# Altium schematic sheet [03] - Converter.SchDoc
size A3
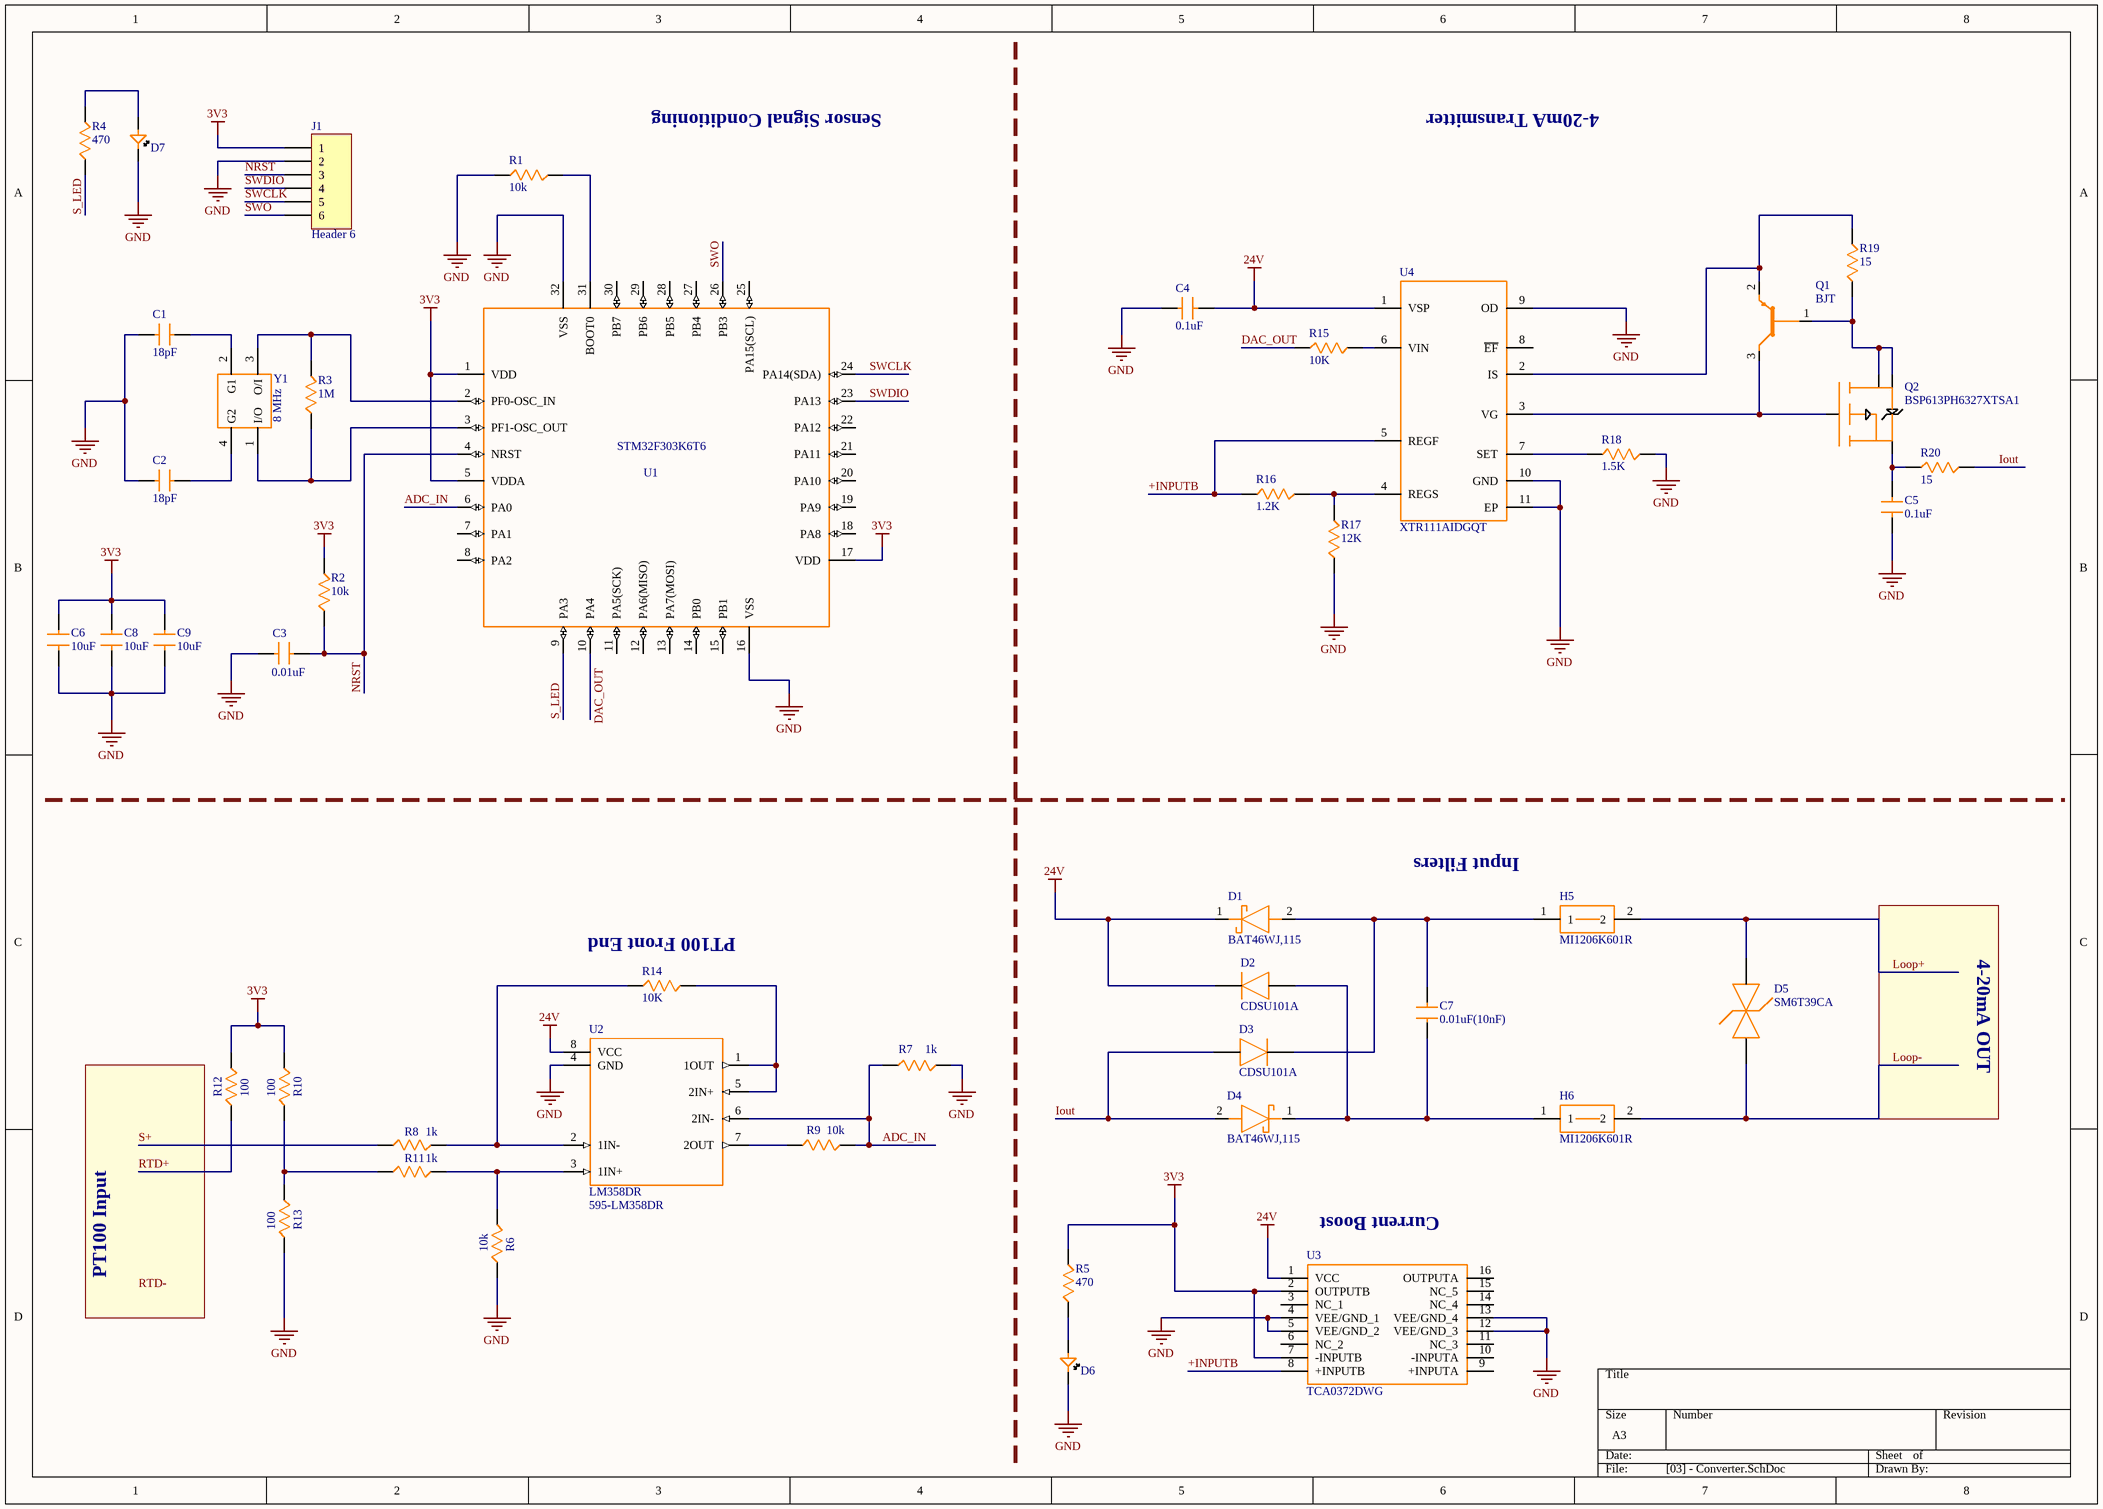
[diagram p0: [03] - Converter.SchDoc]

## Parts
C1  18pF  [C0805]
C2  18pF  [C0805]
C3  0.01uF  [C0805]
C4  0.1uF  [C0805]
C5  0.1uF  [C0805]
C6  10uF  [C0805]
C7  0.01uF(10nF)  [PCBComponent_1]
C8  10uF  [C0805]
C9  10uF  [C0805]
D1  BAT46WJ,115  [BAT46WJ,115]
D2  CDSU101A  [CDSU101A]
D3  CDSU101A  [CDSU101A]
D4  BAT46WJ,115  [BAT46WJ,115]
D5  SM6T39CA  [SM6T39CA]
D6  599-0130-007F  [LED0805]  (value not drawn)
D7  599-0130-007F  [LED0805]  (value not drawn)
H5  MI1206K601R  [MI1206K601R]
H6  MI1206K601R  [MI1206K601R]
J1  Header 6  [HDR1X6]
Q1  BJT  [SMMBT2907ALT3G]
Q2  BSP613PH6327XTSA1  [BSP613PH6327XTA1]
R1  10k  [R0805]
R2  10k  [R0805]
R3  1M  [R0805]
R4  470  [R0805]
R5  470  [R0805]
R6  10k  [R0805]
R7  1k  [R0805]
R8  1k  [R0805]
R9  10k  [R0805]
R10  100  [R0805]
R11  1k  [R0805]
R12  100  [R0805]
R13  100  [R0805]
R14  10K  [R0805]
R15  10K  [R0805]
R16  1.2K  [R0805]
R17  12K  [R0805]
R18  1.5K  [R0805]
R19  15  [R0805]
R20  15  [R0805]
U1  STM32F303K6T6  [STM32F303K6T6]
U2  LM358DR  Supplier Part Number 1: 595-LM358DR  [LM358DR]
U3  TCA0372DWG  [TCA0372DWG]
U4  XTR111AIDGQT  [XTR111AIDGQT]
Y1  8 MHz  [ECS-80-18-30B-AGN]

## Nets
3V3: C6.2 C8.2 C9.2 J1.1 R2.1 R5.2 R10.2 R12.2 U1.1(VDD) U1.5(VDDA) U1.17(VDD) U3.2(OUTPUTB) U3.7(-INPUTB)
24V: C4.1 D1.1(K) D2.1(K) U2.8(VCC) U3.1(VCC) U4.1(VSP)
GND: C1.1 C2.1 C3.1 C4.2 C5.1 C6.1 C8.1 C9.1 D6.2 D7.2 J1.2 R1.1 R6.1 R7.2 R13.1 R17.1 R18.2 U1.16(VSS) U1.32(VSS) U2.4(GND) U3.4(VEE/GND_1) U3.5(VEE/GND_2) U3.12(VEE/GND_3) U3.13(VEE/GND_4) U4.9(OD) U4.10(GND) U4.11(EP)
+INPUTB: R16.1 U3.8(+INPUTB) U4.5(REGF)
ADC_IN: R7.1 R9.1 U1.6(PA0) U2.6(2IN-)
DAC_OUT: R15.2 U1.10(PA4)
Iout: D3.2(A) D4.2(A) R20.1
Loop+: D5.2(A) H5.2
Loop-: D5.1(K) H6.2
NRST: C3.2 J1.3 R2.2 U1.4(NRST)
RTD+: R12.1
S+: R8.1
S_LED: R4.1 U1.9(PA3)
SWCLK: J1.5 U1.24(PA14(SDA))
SWDIO: J1.4 U1.23(PA13)
SWO: J1.6 U1.26(PB3)
NetC1_2: C1.2 Y1.2(G1)
NetC2_2: C2.2 Y1.4(G2)
NetC5_2: C5.2 Q2.3(S) R20.2
NetC7_1: C7.1 D2.2(A) D4.1(K) H6.1
NetC7_2: C7.2 D1.2(A) D3.1(K) H5.1
NetD6_1: D6.1 R5.1
NetD7_1: D7.1 R4.2
NetQ1_1: Q1.1(B) Q2.2(D@1) Q2.4(D@2) R19.1
NetQ1_2: Q1.2(E) R19.2 U4.2(IS)
NetQ1_3: Q1.3(C) Q2.1(G) U4.3(VG)
NetR1_2: R1.2 U1.31(BOOT0)
NetR3_1: R3.1 U1.3(PF1-OSC_OUT) Y1.1(I/O)
NetR3_2: R3.2 U1.2(PF0-OSC_IN) Y1.3(O/I)
NetR6_2: R6.2 R11.2 U2.3(1IN+)
NetR8_2: R8.2 R14.1 U2.2(1IN-)
NetR9_2: R9.2 U2.7(2OUT)
NetR10_1: R10.1 R11.1 R13.2
NetR14_2: R14.2 U2.1(1OUT) U2.5(2IN+)
NetR15_1: R15.1 U4.6(VIN)
NetR16_2: R16.2 R17.2 U4.4(REGS)
NetR18_1: R18.1 U4.7(SET)

Not connected (* = marked no-connect by the designer): U1 7(PA1) 8(PA2) 11(PA5(SCK)) 12(PA6(MISO)) 13(PA7(MOSI)) 14(PB0) 15(PB1) 18(PA8) 19(PA9) 20(PA10) 21(PA11) 22(PA12) 25(PA15(SCL)) 27(PB4) 28(PB5) 29(PB6) 30(PB7); U3 3(NC_1) 6(NC_2) 9(+INPUTA) 10(-INPUTA) 11(NC_3) 14(NC_4) 15(NC_5) 16(OUTPUTA); U4 8(~{EF})

## Notes on the sheet
- Sensor Signal Conditioning
- 4-20mA Transmitter
- Input Filters
- (near R14) PT100 Front End
- 4-20mA OUT
- (near U3) Current Boost
- PT100 Input
- Labels drawn without touching a wire or pin: RTD-

## Library data of the parts
C1 C2 = VJ0805A180KXQPW1BC: Multilayer Ceramic Capacitors MLCC - SMD/SMT 0805 18pF 10volts C0G 10%; Manufacturer: Vishay / Vitramon; Voltage Rating DC: 10 VDC; Class: Class 1; CNHTS: 8532241000; Dielectric: C0G (NP0); TARIC: 8532240000; Supplier 1: Mouser; Manufacturer Part Number: VJ0805A180KXQPW1BC; RoHS: RoHS Compliant; Category: Multilayer Ceramic Capacitors MLCC - SMD/SMT; Stock 1: 27135; Pricing 1: 1=0.120, 50=0.094, 100=0.071, 500=0.050, 1000=0.026, 15000=0.018 (USD); Capacitance: 18 pF; Height: 0.6 mm; Length: 2 mm; Package / Case: 0805 (2012 metric); Packaging: Cut Tape; Product: General Type MLCCs; Series: VJ W1BC Basic Comm; Termination Style: SMD/SMT; Tolerance: 10 %; Voltage Rating AC: -; Width: 1.25 mm; Brand: Vishay / Vitramon; Case Code - in: 0805; Case Code - mm: 2012; HTS Code: 8532240020; Maximum Operating Temperature: + 125 C; Minimum Operating Temperature: - 55 C; Product Type: Ceramic Capacitors; Standard Pack Qty: 15000; Subcategory: Capacitors; Termination: Flexible (Soft); RoHS - Mouser: Y; Minimum Order Quantity: 1; Reeling: True; ComponentLink1URL: http://www.mouser.com/datasheet/2/427/vjw1bcbascomseries-223529.pdf; ComponentLink1Description: http://www.mouser.com/datasheet/2/427/vjw1bcbascomseries-223529.pdf; Supplier Part Number 1: 77-VJ0805A180KXQPBC
C3 = AS0805KRX7R9BB103: Multilayer Ceramic Capacitors MLCC - SMD/SMT 0.01uF 10% 50V AEC-Q200; Manufacturer: Yageo; Voltage Rating DC: 50 VDC; Capacitance - nF: 10 nF; Capacitance - pF: 10000 pF; CNHTS: 8532241000; Dielectric: X7R; TARIC: 8532240000; Product Status: New Product; Supplier 1: Mouser; Manufacturer Part Number: AS0805KRX7R9BB103; RoHS: RoHS Compliant; Category: Multilayer Ceramic Capacitors MLCC - SMD/SMT; Stock 1: 39495; Pricing 1: 1=0.380, 10=0.243, 100=0.124, 1000=0.112, 4000=0.078, 8000=0.076, 24000=0.073, 48000=0.068, 100000=0.063 (USD); Capacitance: 0.01 uF; Height: 0.85 mm; Length: 2 mm; Package / Case: 0805 (2012 metric); Packaging: Cut Tape; Product: Automotive MLCCs; Series: AS; Termination Style: SMD/SMT; Tolerance: 10 %; Width: 1.25 mm; Brand: Yageo; Case Code - in: 0805; Case Code - mm: 2212; HTS Code: 8532240020; Maximum Operating Temperature: + 125 C; Minimum Operating Temperature: - 55 C; Product Type: Ceramic Capacitors; Standard Pack Qty: 4000; Subcategory: Capacitors; Termination: Flexible (Soft); RoHS - Mouser: Y; Minimum Order Quantity: 1; Reeling: True; ComponentLink1URL: http://www.mouser.com/datasheet/2/447/yageodocoutput-1313910.pdf; ComponentLink1Description: http://www.mouser.com/datasheet/2/447/yageodocoutput-1313910.pdf; Supplier Part Number 1: 603-AS0805KRX79BB103
C4 C5 = AS0805KKX7R9BB104: Multilayer Ceramic Capacitors MLCC - SMD/SMT 0.1uF 10% 50V AEC-Q200; Manufacturer: Yageo; Voltage Rating DC: 50 VDC; Capacitance - nF: 100 nF; Capacitance - pF: 100000 pF; CNHTS: 8532241000; Dielectric: X7R; TARIC: 8532240000; Product Status: New Product; Supplier 1: Mouser; Manufacturer Part Number: AS0805KKX7R9BB104; RoHS: RoHS Compliant; Category: Multilayer Ceramic Capacitors MLCC - SMD/SMT; Stock 1: 30283; Pricing 1: 1=0.670, 10=0.461, 100=0.262, 500=0.238, 1000=0.165, 3000=0.156, 6000=0.146, 9000=0.136, 24000=0.122 (USD); Capacitance: 0.1 uF; Height: 1.25 mm; Length: 2 mm; Package / Case: 0805 (2012 metric); Packaging: Cut Tape; Product: Automotive MLCCs; Series: AS; Termination Style: SMD/SMT; Tolerance: 10 %; Width: 1.25 mm; Brand: Yageo; Case Code - in: 0805; Case Code - mm: 2212; HTS Code: 8532240020; Maximum Operating Temperature: + 125 C; Minimum Operating Temperature: - 55 C; Product Type: Ceramic Capacitors; Standard Pack Qty: 3000; Subcategory: Capacitors; Termination: Flexible (Soft); RoHS - Mouser: Y; Minimum Order Quantity: 1; Reeling: True; ComponentLink1URL: http://www.mouser.com/datasheet/2/447/yageodocoutput-1313910.pdf; ComponentLink1Description: http://www.mouser.com/datasheet/2/447/yageodocoutput-1313910.pdf; Supplier Part Number 1: 603-AS0805KKX79BB104
C6 C8 C9 = C0603C106M8PACTU: Multilayer Ceramic Capacitors MLCC - SMD/SMT 10V 10uF 0603 X5R 20%; Manufacturer: KEMET; Voltage Rating DC: 10 VDC; Class: Class 2; CNHTS: 8532241000; TARIC: 8532240000; Product Status: New Product; Supplier 1: Mouser; Manufacturer Part Number: C0603C106M8PACTU; RoHS: RoHS Compliant; Category: Multilayer Ceramic Capacitors MLCC - SMD/SMT; Stock 1: 40000; Pricing 1: 1=0.510, 10=0.318, 100=0.194, 500=0.176, 1000=0.162, 4000=0.108, 8000=0.099, 24000=0.097, 48000=0.092 (USD); Capacitance: 10 uF; Height: 0.8 mm; Length: 1.6 mm; Package / Case: 0603 (1608 metric); Packaging: Cut Tape; Product: General Type MLCCs; Series: SMD Comm X5R; Termination Style: SMD/SMT; Tolerance: 20 %; Width: 0.8 mm; Brand: KEMET; Case Code - in: 0603; Case Code - mm: 1608; Dielectric: X5R; HTS Code: 8532240020; Maximum Operating Temperature: + 85 C; Minimum Operating Temperature: - 55 C; Product Type: Ceramic Capacitors; Standard Pack Qty: 4000; Subcategory: Capacitors; Termination: Standard; RoHS - Mouser: Y; Minimum Order Quantity: 1; Reeling: True; ComponentLink1URL: http://www.mouser.com/datasheet/2/212/KEM_C1006_X5R_SMD-1103249.pdf; ComponentLink1Description: http://www.mouser.com/datasheet/2/212/KEM_C1006_X5R_SMD-1103249.pdf; Supplier Part Number 1: 80-C0603C106M8PACTU
C7 = C0805X103K1GECAUTO: Multilayer Ceramic Capacitors MLCC - SMD/SMT 100V 0.01uF C0G 0805 10% AEC-Q200; Manufacturer: KEMET; Voltage Rating DC: 100 VDC; Capacitance - pF: 10000 pF; Class: Class 1; CNHTS: 8532241000; Dielectric: C0G (NP0); TARIC: 8532240000; Product Status: New Product; Supplier 1: Mouser; Manufacturer Part Number: C0805X103K1GECAUTO; RoHS: RoHS Compliant; Category: Multilayer Ceramic Capacitors MLCC - SMD/SMT; Stock 1: 11054; Pricing 1: 1=0.360, 10=0.206, 100=0.124, 500=0.113, 1000=0.102, 4000=0.088 (USD); Capacitance: 0.01 uF; Length: 2 mm; Package / Case: 0805 (2012 metric); Packaging: Cut Tape; Product: Automotive MLCCs; Series: ESD SMD Auto C0G; Termination Style: SMD/SMT; Tolerance: 10 %; Width: 1.25 mm; Brand: KEMET; Capacitance - nF: 10 nF; Case Code - in: 0805; Case Code - mm: 2012; HTS Code: 8532240020; Maximum Operating Temperature: + 125 C; Minimum Operating Temperature: - 55 C; Product Type: Ceramic Capacitors; Qualification: AEC-Q200; Standard Pack Qty: 4000; Subcategory: Capacitors; Termination: Flexible (Soft); RoHS - Mouser: Y; Minimum Order Quantity: 1; Reeling: True; ComponentLink1URL: http://www.mouser.com/datasheet/2/212/KEM_C1091_C0G_ESD-1140493.pdf; ComponentLink1Description: http://www.mouser.com/datasheet/2/212/KEM_C1091_C0G_ESD-1140493.pdf; Supplier Part Number 1: 80-C0805X103K1GEAUTO
D1 D4 = BAT46WJ,115: Schottky Diodes & Rectifiers Schottky Diodes 100V 250mA Single; Manufacturer: Nexperia; CNHTS: 8541100000; Ifsm - Forward Surge Current: 2.5 A; Ir - Reverse Current: 2 uA; MXHTS: 85411001; Pd - Power Dissipation: 400 mW; trr - Reverse Recovery time: 5.9 ns; Vf - Forward Voltage: 710 mV; Supplier 1: Mouser; Manufacturer Part Number: BAT46WJ,115; RoHS: RoHS Compliant; Category: Schottky Diodes & Rectifiers; Stock 1: 354863; Pricing 1: 1=0.370, 10=0.245, 100=0.105, 1000=0.081, 3000=0.062, 9000=0.055, 24000=0.051, 45000=0.046, 99000=0.044 (USD); Configuration: Single; Package / Case: SOD-323-2; Packaging: Cut Tape; Product: Schottky Diodes; Technology: Si; Brand: Nexperia; Mounting Style: SMD/SMT; HTS Code: 8541100070; If - Forward Current: 250 mA; Product Type: Schottky Diodes & Rectifiers; Standard Pack Qty: 3000; Subcategory: Diodes & Rectifiers; TARIC: 8541100000; Vrrm - Repetitive Reverse Voltage: 100 V; RoHS - Mouser: Y; Minimum Order Quantity: 1; Reeling: True; ComponentLink1URL: http://www.mouser.com/datasheet/2/916/BAT46WJ-1527107.pdf; ComponentLink1Description: http://www.mouser.com/datasheet/2/916/BAT46WJ-1527107.pdf; Supplier Part Number 1: 771-BAT46WJ115
D2 D3 = CDSU101A: Diodes - General Purpose, Power, Switching 100mA 80V Sm Sgnl Switching; Manufacturer: Comchip Technology; Configuration: Single; Max Surge Current: 1 A; Recovery Time: 4 ns; CNHTS: 8541100000; Ir - Reverse Current: 50 nA; Maximum Diode Capacitance: 3 pF; MXHTS: 85414001; Pd - Power Dissipation: 150 mW; Peak Reverse Voltage: 90 V; Vf - Forward Voltage: 1 V; Supplier 1: Mouser; Manufacturer Part Number: CDSU101A; RoHS: RoHS Compliant; Category: Diodes - General Purpose, Power, Switching; Stock 1: 163219; Pricing 1: 1=0.220, 10=0.186, 100=0.066, 1000=0.045, 4000=0.034, 8000=0.029, 24000=0.026, 48000=0.024, 100000=0.020 (USD); Package / Case: SOD-523F-2; Packaging: Cut Tape; Product: Switching Diodes; Series: CDSU101A; Termination Style: SMD/SMT; Brand: Comchip Technology; Mounting Style: SMD/SMT; HTS Code: 8541100070; If - Forward Current: 100 mA; Maximum Operating Temperature: + 125 C; Minimum Operating Temperature: - 40 C; Product Type: Diodes - General Purpose, Power, Switching; Standard Pack Qty: 4000; Subcategory: Diodes & Rectifiers; TARIC: 8541100000; RoHS - Mouser: Y; Minimum Order Quantity: 1; Reeling: True; ComponentLink1URL: http://www.mouser.com/datasheet/2/80/CDSU101A-HF-RevC212779-1481184.pdf; ComponentLink1Description: http://www.mouser.com/datasheet/2/80/CDSU101A-HF-RevC212779-1481184.pdf; Supplier Part Number 1: 750-CDSU101A
D5 = SM6T39CA: ESD Suppressors / TVS Diodes 600W 39V Bidirect; Manufacturer: STMicroelectronics; Breakdown Voltage: 37.1 V to 41 V; Clamping Voltage: 69.7 V; CNHTS: 8541100000; MXHTS: 85411001; Polarity: Bidirectional; Working Voltage: 33.3 V; Supplier 1: Mouser; Manufacturer Part Number: SM6T39CA; RoHS: RoHS Compliant; Category: ESD Suppressors / TVS Diodes; Stock 1: 18746; Pricing 1: 1=0.480, 10=0.394, 100=0.240, 1000=0.186, 2500=0.158, 10000=0.148, 25000=0.140, 50000=0.137 (USD); Package / Case: DO-214AA-2 (SMB); Packaging: Cut Tape; Series: SM6T; Termination Style: SMD/SMT; Brand: STMicroelectronics; HTS Code: 8541100080; Maximum Operating Temperature: + 175 C; Minimum Operating Temperature: - 65 C; Product Type: TVS Diodes; Standard Pack Qty: 2500; Subcategory: TVS Diodes / ESD Suppression Diodes; TARIC: 8541100000; Tradename: Transil; Vesd - Voltage ESD Air Gap: -; Vesd - Voltage ESD Contact: -; RoHS - Mouser: Y; Minimum Order Quantity: 1; Reeling: True; ComponentLink1URL: http://www.mouser.com/datasheet/2/389/sm6t-955193.pdf; ComponentLink1Description: http://www.mouser.com/datasheet/2/389/sm6t-955193.pdf; Supplier Part Number 1: 511-SM6T39CA
D6 D7 = 599-0130-007F: Standard LEDs - SMD SMD 0805 ORANGE; Manufacturer: Dialight; Lens Color/Style: Clear; Luminous Intensity: 95 mcd; Viewing Angle: 140 deg; CNHTS: 8541401000; If - Forward Current: 20 mA; Vf - Forward Voltage: 2.1 V; Wavelength/Color Temperature: 605 nm; Product Status: New Product; Supplier 1: Mouser; Manufacturer Part Number: 599-0130-007F; RoHS: RoHS Compliant; Category: Standard LEDs - SMD; Stock 1: 15445; Pricing 1: 1=0.450, 10=0.264, 100=0.106, 1000=0.083, 2500=0.060, 4000=0.060, 8000=0.053, 24000=0.050 (USD); Height: 0.7 mm; Illumination Color: Orange; Length: 2 mm; Orientation: Top View; Package / Case: 0805 (2012 metric); Packaging: Cut Tape; Product: Orange LEDs; Width: 1.25 mm; Brand: Dialight; Mounting Style: SMD/SMT; HTS Code: 8541402000; Maximum Operating Temperature: + 100 C; Minimum Operating Temperature: - 40 C; Product Type: LED - Standard; Standard Pack Qty: 4000; Subcategory: LEDs; RoHS - Mouser: Y; Minimum Order Quantity: 1; Reeling: True; ComponentLink1URL: http://www.mouser.com/datasheet/2/109/Dialight_CBI_data_599-0805_Apr2018-1370606.pdf; ComponentLink1Description: http://www.mouser.com/datasheet/2/109/Dialight_CBI_data_599-0805_Apr2018-1370606.pdf; Supplier Part Number 1: 645-599-0130-007F
H5 H6 = MI1206K601R-10: Ferrite Beads 600ohms 100MHz 1.5A Monolithic 1206 SMD; Manufacturer: Laird; Maximum DC Resistance: 80 mOhms; CNHTS: 8505190090; MXHTS: 85049099; TARIC: 8504901110; Supplier 1: Mouser; Manufacturer Part Number: MI1206K601R-10; RoHS: RoHS Compliant; Category: Ferrite Beads; Stock 1: 100743; Pricing 1: 1=0.100, 10=0.024, 50=0.022, 250=0.021, 500=0.019, 1000=0.018, 3000=0.017 (USD); Capacitance: -; Height: 1.4 mm; Impedance: 600 Ohms; Length: 3.2 mm; Maximum DC Current: 1.5 A; Operating Temperature Range: - 40 C to + 125 C; Package / Case: 1206 (3216 metric); Packaging: Cut Tape; Product: Ferrite Chip Beads; Series: MI; Termination Style: SMD/SMT; Type: Differential Mode Ferrite Chip Bead Power; Width: 2.5 mm; Brand: Laird; HTS Code: 8504909690; Maximum Operating Temperature: + 125 C; Minimum Operating Temperature: - 40 C; Product Type: Ferrite Beads; Standard Pack Qty: 3000; Subcategory: Ferrites; Termination: -; Test Frequency: 100 MHz; RoHS - Mouser: Y; Minimum Order Quantity: 1; Reeling: True; Supplier Part Number 1: 875-MI1206K601R-10
J1 = Header 6: Header, 6-Pin; LatestRevisionDate: 17-Jul-2002; LatestRevisionNote: Re-released for DXP Platform.; Publisher: Altium Limited
Q1 = SMMBT2907ALT3G: Bipolar Transistors - BJT SS GP XSTR SPCL TR; Manufacturer: ON Semiconductor; Collector- Base Voltage VCBO: - 60 V; Configuration: Single; DC Current Gain hFE Max: 300; Emitter- Base Voltage VEBO: - 5 V; Collector-Emitter Saturation Voltage: - 1.6 V; Continuous Collector Current: - 600 mA; Transistor Polarity: PNP; CNHTS: 8541210000; DC Collector/Base Gain hfe Min: 50; Gain Bandwidth Product fT: 200 MHz; Maximum DC Collector Current: - 1200 mA; MXHTS: 85412101; Pd - Power Dissipation: 350 mW; Qualification: AEC-Q101; Supplier 1: Mouser; Manufacturer Part Number: SMMBT2907ALT3G; RoHS: RoHS Compliant; Category: Bipolar Transistors - BJT; Stock 1: 22927; Pricing 1: 1=0.250, 10=0.169, 100=0.071, 1000=0.048, 2500=0.038, 10000=0.032, 20000=0.030, 50000=0.029 (USD); Collector- Emitter Voltage VCEO Max: - 60 V; Package / Case: SOT-23-3; Packaging: Cut Tape; Series: MMBT2907AL; Technology: Si; Brand: ON Semiconductor; Mounting Style: SMD/SMT; HTS Code: 8541210095; Maximum Operating Temperature: + 150 C; Minimum Operating Temperature: - 55 C; Product Type: BJTs - Bipolar Transistors; Standard Pack Qty: 10000; Subcategory: Transistors; TARIC: 8541210000; RoHS - Mouser: Y; Minimum Order Quantity: 1; Reeling: True; ComponentLink1URL: http://www.mouser.com/datasheet/2/308/MMBT2907ALT1-D-1293016.pdf; ComponentLink1Description: http://www.mouser.com/datasheet/2/308/MMBT2907ALT1-D-1293016.pdf; Supplier Part Number 1: 863-SMMBT2907ALT3G
Q2 = BSP613PH6327XTSA1: MOSFET P-Ch -60V -2.9A SOT-223-3; Manufacturer: Infineon Technologies; Configuration: Single; Transistor Type: 1 P-Channel; Forward Transconductance - Min: 2.7 S; Number of Channels: 1 Channel; Transistor Polarity: P-Channel; Channel Mode: Enhancement; CNHTS: 8541290000; Fall Time: 7 ns; Id - Continuous Drain Current: 2.9 A; MXHTS: 85412999; Pd - Power Dissipation: 1.8 W; Qg - Gate Charge: 22 nC; Rds On - Drain-Source Resistance: 130 mOhms; Rise Time: 9 ns; Typical Turn-Off Delay Time: 26 ns; Typical Turn-On Delay Time: 6.7 ns; Vds - Drain-Source Breakdown Voltage: 60 V; Vgs - Gate-Source Voltage: 10 V; Vgs th - Gate-Source Threshold Voltage: 2.1 V; Supplier 1: Mouser; Manufacturer Part Number: BSP613PH6327XTSA1; RoHS: RoHS Compliant; Category: MOSFET; Stock 1: 2318; Pricing 1: 1=1.02, 10=0.878, 100=0.675, 500=0.596, 1000=0.471 (USD); Height: 1.6 mm; Length: 6.5 mm; Package / Case: PG-SOT-223-4; Packaging: Cut Tape; Series: BSP613; Technology: Si; Width: 3.5 mm; Brand: Infineon Technologies; Mounting Style: SMD/SMT; HTS Code: 8541290095; Maximum Operating Temperature: + 150 C; Minimum Operating Temperature: - 55 C; Product Type: MOSFET; Standard Pack Qty: 1000; Subcategory: MOSFETs; TARIC: 8541290000; RoHS - Mouser: Y; Minimum Order Quantity: 1; Reeling: True; ComponentLink1URL: http://www.mouser.com/datasheet/2/196/Infineon-BSP613P-DS-v02_08-EN-1226270.pdf; ComponentLink1Description: http://www.mouser.com/datasheet/2/196/Infineon-BSP613P-DS-v02_08-EN-1226270.pdf
R1 R2 R6 R9 = RT0603FRE0710KL: Thin Film Resistors - SMD 10K ohm 1% 1/10W; Manufacturer: Yageo; Power Rating: 100 mW (1/10 W); Resistance: 10 kOhms; Temperature Coefficient: 50 PPM / C; Voltage Rating: 75 V; CNHTS: 8533211000; MXHTS: 85332101; TARIC: 8533210000; Supplier 1: Mouser; Manufacturer Part Number: RT0603FRE0710KL; RoHS: RoHS Compliant By Exemption; Category: Thin Film Resistors - SMD; Stock 1: 366564; Pricing 1: 1=0.100, 10=0.045, 100=0.015, 1000=0.009, 5000=0.007, 10000=0.006, 25000=0.005 (USD); Features: -; Height: 0.45 mm; Length: 1.6 mm; Operating Temperature Range: - 55 C to + 155 C; Package / Case: 0603 (1608 metric); Packaging: Cut Tape; Product: Precision Resistors Thin Film SMD; Series: RT; Termination Style: SMD/SMT; Tolerance: 1 %; Type: High Stability Chip Resistors; Width: 0.8 mm; Brand: Yageo; Case Code - in: 0603; Case Code - mm: 1608; HTS Code: 8533210030; Maximum Operating Temperature: + 155 C; Minimum Operating Temperature: - 55 C; Product Type: Thin Film Resistors; Standard Pack Qty: 5000; Subcategory: Resistors; RoHS - Mouser: E; Minimum Order Quantity: 1; Reeling: True; ComponentLink1URL: http://www.mouser.com/datasheet/2/447/PYu-RT_1-to-0.01_RoHS_L_9-1222720.pdf; ComponentLink1Description: http://www.mouser.com/datasheet/2/447/PYu-RT_1-to-0.01_RoHS_L_9-1222720.pdf; Supplier Part Number 1: 603-RT0603FRE0710KL
R3 = AT0805DRD071ML: Thin Film Resistors - SMD 1 Mohm 0.5% Tol. AEC-Q200; Manufacturer: Yageo; Power Rating: 125 mW (1/8 W); Resistance: 1 MOhms; Temperature Coefficient: 25 PPM / C; Voltage Rating: 150 V; CNHTS: 8533211000; MXHTS: 85332101; TARIC: 8533210000; Supplier 1: Mouser; Manufacturer Part Number: AT0805DRD071ML; RoHS: RoHS Compliant; Category: Thin Film Resistors - SMD; Stock 1: 10768; Pricing 1: 1=0.550, 10=0.322, 100=0.129, 1000=0.099, 5000=0.076, 10000=0.074, 25000=0.071, 50000=0.070, 100000=0.069 (USD); Diameter: -; Features: -; Height: 0.5 mm; Length: 2 mm; Operating Temperature Range: - 55 C to + 125 C; Package / Case: 0805 (2012 metric); Packaging: Cut Tape; Product: Thin Film Resistors SMD; Series: AT; Technology: Thin Film; Termination Style: SMD/SMT; Tolerance: 0.5 %; Type: High Precision High Stability Chip Resistors; Width: 1.25 mm; Brand: Yageo; Mounting Style: PCB Mount; Case Code - in: 0805; Case Code - mm: 2012; HTS Code: 8533210030; Maximum Operating Temperature: + 125 C; Minimum Operating Temperature: - 55 C; Product Type: Thin Film Resistors; Qualification: AEC-Q200; Standard Pack Qty: 5000; Subcategory: Resistors; RoHS - Mouser: Y; Minimum Order Quantity: 1; Reeling: True; ComponentLink1URL: http://www.mouser.com/datasheet/2/447/PYu-AT_51_RoHS_L_5-1222714.pdf; ComponentLink1Description: http://www.mouser.com/datasheet/2/447/PYu-AT_51_RoHS_L_5-1222714.pdf; Supplier Part Number 1: 603-AT0805DRD071ML
R4 R5 = RT0603FRE07470RL: Thin Film Resistors - SMD 1/10W 470 ohm 1% 50ppm; Manufacturer: Yageo; Power Rating: 100 mW (1/10 W); Resistance: 470 Ohms; Temperature Coefficient: 50 PPM / C; Voltage Rating: 75 V; CNHTS: 8533211000; MXHTS: 85332101; TARIC: 8533210000; Supplier 1: Mouser; Manufacturer Part Number: RT0603FRE07470RL; RoHS: RoHS Compliant By Exemption; Category: Thin Film Resistors - SMD; Stock 1: 26277; Pricing 1: 1=0.190, 10=0.046, 100=0.015, 1000=0.011, 5000=0.007, 25000=0.006, 50000=0.005 (USD); Features: -; Height: 0.45 mm; Length: 1.6 mm; Operating Temperature Range: - 55 C to + 155 C; Package / Case: 0603 (1608 metric); Packaging: Cut Tape; Product: Precision Resistors Thin Film SMD; Series: RT; Termination Style: SMD/SMT; Tolerance: 1 %; Type: High Stability Chip Resistors; Width: 0.8 mm; Brand: Yageo; Case Code - in: 0603; Case Code - mm: 1608; HTS Code: 8533210030; Maximum Operating Temperature: + 155 C; Minimum Operating Temperature: - 55 C; Product Type: Thin Film Resistors; Standard Pack Qty: 5000; Subcategory: Resistors; RoHS - Mouser: E; Minimum Order Quantity: 1; Reeling: True; ComponentLink1URL: http://www.mouser.com/datasheet/2/447/PYu-RT_1-to-0.01_RoHS_L_9-1222720.pdf; ComponentLink1Description: http://www.mouser.com/datasheet/2/447/PYu-RT_1-to-0.01_RoHS_L_9-1222720.pdf; Supplier Part Number 1: 603-RT0603FRE07470RL
R7 R8 R11 = RT0603FRE071KL: Thin Film Resistors - SMD 1K ohm 1% 1/10W; Manufacturer: Yageo; Power Rating: 100 mW (1/10 W); Resistance: 1 kOhms; Temperature Coefficient: 50 PPM / C; Voltage Rating: 75 V; CNHTS: 8533211000; MXHTS: 85332101; TARIC: 8533210000; Supplier 1: Mouser; Manufacturer Part Number: RT0603FRE071KL; RoHS: RoHS Compliant By Exemption; Category: Thin Film Resistors - SMD; Stock 1: 182041; Pricing 1: 1=0.100, 10=0.045, 100=0.015, 1000=0.009, 5000=0.007, 10000=0.006, 25000=0.005 (USD); Features: -; Height: 0.45 mm; Length: 1.6 mm; Operating Temperature Range: - 55 C to + 155 C; Package / Case: 0603 (1608 metric); Packaging: Cut Tape; Product: Precision Resistors Thin Film SMD; Series: RT; Termination Style: SMD/SMT; Tolerance: 1 %; Type: High Stability Chip Resistors; Width: 0.8 mm; Brand: Yageo; Case Code - in: 0603; Case Code - mm: 1608; HTS Code: 8533210030; Maximum Operating Temperature: + 155 C; Minimum Operating Temperature: - 55 C; Product Type: Thin Film Resistors; Standard Pack Qty: 5000; Subcategory: Resistors; RoHS - Mouser: E; Minimum Order Quantity: 1; Reeling: True; ComponentLink1URL: http://www.mouser.com/datasheet/2/447/PYu-RT_1-to-0.01_RoHS_L_9-1222720.pdf; ComponentLink1Description: http://www.mouser.com/datasheet/2/447/PYu-RT_1-to-0.01_RoHS_L_9-1222720.pdf; Supplier Part Number 1: 603-RT0603FRE071KL
R10 R12 R13 = RT0603FRE07100RL: Thin Film Resistors - SMD 1/10W 100 ohm 1% 50ppm; Manufacturer: Yageo; Power Rating: 100 mW (1/10 W); Resistance: 100 Ohms; Temperature Coefficient: 50 PPM / C; Voltage Rating: 75 V; CNHTS: 8533211000; MXHTS: 85332101; TARIC: 8533210000; Supplier 1: Mouser; Manufacturer Part Number: RT0603FRE07100RL; RoHS: RoHS Compliant By Exemption; Category: Thin Film Resistors - SMD; Stock 1: 57200; Pricing 1: 1=0.190, 10=0.046, 100=0.015, 1000=0.011, 5000=0.007, 25000=0.006, 50000=0.005 (USD); Features: -; Height: 0.45 mm; Length: 1.6 mm; Operating Temperature Range: - 55 C to + 155 C; Package / Case: 0603 (1608 metric); Packaging: Cut Tape; Product: Precision Resistors Thin Film SMD; Series: RT; Termination Style: SMD/SMT; Tolerance: 1 %; Type: High Stability Chip Resistors; Width: 0.8 mm; Brand: Yageo; Case Code - in: 0603; Case Code - mm: 1608; HTS Code: 8533210030; Maximum Operating Temperature: + 155 C; Minimum Operating Temperature: - 55 C; Product Type: Thin Film Resistors; Standard Pack Qty: 5000; Subcategory: Resistors; RoHS - Mouser: E; Minimum Order Quantity: 1; Reeling: True; ComponentLink1URL: http://www.mouser.com/datasheet/2/447/PYu-RT_1-to-0.01_RoHS_L_9-1222720.pdf; ComponentLink1Description: http://www.mouser.com/datasheet/2/447/PYu-RT_1-to-0.01_RoHS_L_9-1222720.pdf; Supplier Part Number 1: 603-RT0603FRE07100RL
R14 R15 = RC0805FR-7W10KL: Thick Film Resistors - SMD 10K   OHM   1% 1/4W; Manufacturer: Yageo; Power Rating: 125 mW, 250 mW; Resistance: 10 kOhms; Temperature Coefficient: 100 PPM / C; Voltage Rating: 150 V; CNHTS: 8533211000; MXHTS: 85332101; TARIC: 8533210000; Supplier 1: Mouser; Manufacturer Part Number: RC0805FR-7W10KL; RoHS: RoHS Compliant; Category: Thick Film Resistors - SMD; Stock 1: 8240; Pricing 1: 1=0.190, 10=0.115, 100=0.038, 1000=0.026, 5000=0.020, 10000=0.019, 25000=0.018, 100000=0.017 (USD); Application: High Reliability; Features: -; Height: 0.5 mm; Length: 2 mm; Package / Case: 0805 (2012 metric); Packaging: Cut Tape; Product: Thick Film Resistors SMD; Series: RC; Technology: Thick Film; Termination Style: SMD/SMT; Tolerance: 1 %; Type: High Power; Width: 1.25 mm; Brand: Yageo; Mounting Style: PCB Mount; Case Code - in: 0805; Case Code - mm: 2012; HTS Code: 8533210030; Maximum Operating Temperature: + 155 C; Minimum Operating Temperature: - 55 C; Product Type: Thick Film Resistors; Standard Pack Qty: 5000; Subcategory: Resistors; RoHS - Mouser: Y; Minimum Order Quantity: 1; Reeling: True; ComponentLink1URL: http://www.mouser.com/datasheet/2/447/yageo_01152019_DESIGN_KITS_8_2012-1522572.pdf; ComponentLink1Description: http://www.mouser.com/datasheet/2/447/yageo_01152019_DESIGN_KITS_8_2012-1522572.pdf; Supplier Part Number 1: 603-RC0805FR-7W10KL
R16 = RCS08051K20FKEA: Thick Film Resistors - SMD 0.4watt 1.2Kohms 1% 100ppm; Manufacturer: Vishay; Power Rating: 400 mW; Temperature Coefficient: 100 PPM / C; Voltage Rating: 150 V; CNHTS: 8533211000; MXHTS: 85332101; Qualification: AEC-Q200; TARIC: 8533210000; Supplier 1: Mouser; Manufacturer Part Number: RCS08051K20FKEA; RoHS: RoHS Compliant By Exemption; Category: Thick Film Resistors - SMD; Stock 1: 7307; Pricing 1: 1=0.240, 100=0.081, 250=0.062, 500=0.049, 1000=0.034, 2000=0.031, 5000=0.025 (USD); Application: Automotive Grade; Features: Anti-Surge Resistors; Height: 0.45 mm; Length: 2 mm; Package / Case: -; Packaging: Cut Tape; Product: Thick Film Resistors SMD; Resistance: 1.2 kOhms; Series: RCS e3; Technology: Thick Film; Termination Style: SMD/SMT; Tolerance: 1 %; Type: Anti-Surge Resistor; Width: 1.2 mm; Brand: Vishay; Mounting Style: PCB Mount; Case Code - in: 0805; Case Code - mm: 2012; HTS Code: 8533210030; Maximum Operating Temperature: + 155 C; Minimum Operating Temperature: - 55 C; Product Type: Thick Film Resistors; Standard Pack Qty: 5000; Subcategory: Resistors; RoHS - Mouser: E; Minimum Order Quantity: 1; Reeling: True; ComponentLink1URL: http://www.mouser.com/datasheet/2/427/rcse3-1013761.pdf; ComponentLink1Description: http://www.mouser.com/datasheet/2/427/rcse3-1013761.pdf; Supplier Part Number 1: 71-RCS08051K20FKEA
R17 = RC0805FR-0712KL: Thick Film Resistors - SMD 12K OHM 1%; Manufacturer: Yageo; Power Rating: 125 mW, 250 mW; Resistance: 12 kOhms; Temperature Coefficient: 100 PPM / C; Voltage Rating: 150 V; CNHTS: 8533211000; MXHTS: 85332101; TARIC: 8533210000; Supplier 1: Mouser; Manufacturer Part Number: RC0805FR-0712KL; RoHS: RoHS Compliant; Category: Thick Film Resistors - SMD; Stock 1: 111686; Pricing 1: 1=0.130, 10=0.031, 100=0.011, 1000=0.008, 5000=0.005, 25000=0.004 (USD); Application: High Reliability; Features: -; Height: 0.5 mm; Length: 2 mm; Package / Case: 0805 (2012 metric); Packaging: Cut Tape; Product: Thick Film Resistors SMD; Series: RC; Technology: Thick Film; Termination Style: SMD/SMT; Tolerance: 1 %; Type: General Purpose; Width: 1.25 mm; Brand: Yageo; Mounting Style: PCB Mount; Case Code - in: 0805; Case Code - mm: 2012; HTS Code: 8533210030; Maximum Operating Temperature: + 155 C; Minimum Operating Temperature: - 55 C; Product Type: Thick Film Resistors; Standard Pack Qty: 5000; Subcategory: Resistors; RoHS - Mouser: Y; Minimum Order Quantity: 1; Reeling: True; ComponentLink1URL: http://www.mouser.com/datasheet/2/447/yageo_01152019_DESIGN_KITS_8_2012-1522572.pdf; ComponentLink1Description: http://www.mouser.com/datasheet/2/447/yageo_01152019_DESIGN_KITS_8_2012-1522572.pdf; Supplier Part Number 1: 603-RC0805FR-0712KL
R18 = RT0805FRE101K5L: Thin Film Resistors - SMD 1.5K ohm 1% 50 ppm Thin Film; Manufacturer: Yageo; Power Rating: 125 mW (1/8 W); Resistance: 1.5 kOhms; Temperature Coefficient: 50 PPM / C; Voltage Rating: 150 V; CNHTS: 8533211000; MXHTS: 85332101; TARIC: 8533210000; Product Status: New Product; Supplier 1: Mouser; Manufacturer Part Number: RT0805FRE101K5L; RoHS: RoHS Compliant; Category: Thin Film Resistors - SMD; Stock 1: 16494; Pricing 1: 1=0.120, 10=0.064, 100=0.023, 1000=0.016, 2500=0.011, 10000=0.010, 50000=0.009 (USD); Features: -; Height: 0.5 mm; Length: 2 mm; Package / Case: 0805 (2012 metric); Packaging: Cut Tape; Product: Precision Resistors Thin Film SMD; Series: RT; Termination Style: SMD/SMT; Tolerance: 1 %; Type: High Stability Thin Film Chip Resistor; Width: 1.25 mm; Brand: Yageo; Case Code - in: 0805; Case Code - mm: 2012; HTS Code: 8533210030; Maximum Operating Temperature: + 155 C; Minimum Operating Temperature: - 55 C; Standard Pack Qty: 10000; RoHS - Mouser: Y; Minimum Order Quantity: 1; Reeling: True; ComponentLink1URL: http://www.mouser.com/datasheet/2/447/PYu-RT_1-to-0.01_RoHS_L_9-1222720.pdf; ComponentLink1Description: http://www.mouser.com/datasheet/2/447/PYu-RT_1-to-0.01_RoHS_L_9-1222720.pdf; Supplier Part Number 1: 603-RT0805FRE101K5L
R19 R20 = AT0805BRD0715RL: Thin Film Resistors - SMD 15 Ohms 0.1% Tol. AEC-Q200; Manufacturer: Yageo; Power Rating: 125 mW (1/8 W); Resistance: 15 Ohms; Temperature Coefficient: 25 PPM / C; Voltage Rating: 150 V; CNHTS: 8533211000; MXHTS: 85332101; TARIC: 8533210000; Supplier 1: Mouser; Manufacturer Part Number: AT0805BRD0715RL; RoHS: RoHS Compliant; Category: Thin Film Resistors - SMD; Stock 1: 5390; Pricing 1: 1=0.590, 10=0.416, 100=0.236, 1000=0.191, 5000=0.164, 10000=0.159, 25000=0.155, 50000=0.154 (USD); Diameter: -; Features: -; Height: 0.5 mm; Length: 2 mm; Operating Temperature Range: - 55 C to + 125 C; Package / Case: 0805 (2012 metric); Packaging: Cut Tape; Product: Thin Film Resistors SMD; Series: AT; Termination Style: SMD/SMT; Tolerance: 0.1 %; Type: High Precision High Stability Chip Resistors; Width: 1.25 mm; Brand: Yageo; Case Code - in: 0805; Case Code - mm: 2012; HTS Code: 8533210030; Maximum Operating Temperature: + 125 C; Minimum Operating Temperature: - 55 C; Qualification: AEC-Q200; Standard Pack Qty: 5000; RoHS - Mouser: Y; Minimum Order Quantity: 1; Reeling: True; ComponentLink1URL: http://www.mouser.com/datasheet/2/447/PYu-AT_51_RoHS_L_5-1222714.pdf; ComponentLink1Description: http://www.mouser.com/datasheet/2/447/PYu-AT_51_RoHS_L_5-1222714.pdf; Supplier Part Number 1: 603-AT0805BRD0715RL
U1 = STM32F303K6T6: ARM Microcontrollers - MCU 16/32-BITS MICROS; Manufacturer: STMicroelectronics; CNHTS: 8542319000; MXHTS: 85423102; Processor Series: ARM Cortex M; Supplier 1: Mouser; Manufacturer Part Number: STM32F303K6T6; RoHS: RoHS Compliant; Category: ARM Microcontrollers - MCU; Stock 1: 0; Pricing 1: 1=3.82, 10=3.25, 100=2.82, 250=2.67, 500=2.40, 1000=2.03, 2500=1.92, 5000=1.85 (USD); Series: STM32F303K6; Brand: STMicroelectronics; HTS Code: 8542310001; Product Type: ARM Microcontrollers - MCU; Standard Pack Qty: 1500; Subcategory: Microcontrollers - MCU; TARIC: 8542319000; Tradename: STM32; RoHS - Mouser: Y; Minimum Order Quantity: 1; Reeling: False; ComponentLink1URL: http://www.mouser.com/datasheet/2/389/stm32f303c6-956234.pdf; ComponentLink1Description: http://www.mouser.com/datasheet/2/389/stm32f303c6-956234.pdf
U2 = LM358DR: Operational Amplifiers - Op Amps Dual Op Amp; Manufacturer: Texas Instruments; Amplifier Type: High Gain Amplifier; Input Type: Rail-to-Rail; Supply Type: Single, Dual; Number of Channels: 2 Channel; Shutdown: No Shutdown; CMRR - Common Mode Rejection Ratio: 65 dB to 80 dB; CNHTS: 8542319000; Dual Supply Voltage: +/- 3 V, +/- 5 V, +/- 9 V; en - Input Voltage Noise Density: 40 nV/sqrt Hz; GBP - Gain Bandwidth Product: 700 kHz; Ib - Input Bias Current: 150 nA; Maximum Dual Supply Voltage: +/- 16 V; Minimum Dual Supply Voltage: +/- 1.5 V; MXHTS: 85423399; Operating Supply Current: 350 uA; Operating Supply Voltage: 3 V to 32 V, +/- 1.5 V to +/- 16 V; Output Current per Channel: 30 mA; SR - Slew Rate: 0.3 V/us; Supply Voltage - Max: 32 V; Supply Voltage - Min: 3 V; Vcm - Common Mode Voltage: Negative Rail to Positive Rail - 1.5 V; Voltage Gain dB: 100 dB; Vos - Input Offset Voltage: 7 mV; Supplier 1: Mouser; Manufacturer Part Number: LM358DR; RoHS: RoHS Compliant; Category: Operational Amplifiers - Op Amps; Stock 1: 61482; Pricing 1: 1=0.490, 10=0.329, 100=0.156, 1000=0.120, 2500=0.099, 10000=0.090, 22500=0.085, 50000=0.076, 100000=0.073 (USD); Features: Standard Amps; Height: 1.58 mm; Length: 4.9 mm; Package / Case: SOIC-8; Packaging: Cut Tape; Product: Operational Amplifiers; Series: LM358; Technology: Bipolar; Width: 3.91 mm; Brand: Texas Instruments; Mounting Style: SMD/SMT; HTS Code: 8542330001; Maximum Operating Temperature: + 70 C; Minimum Operating Temperature: 0 C; Product Type: Op Amps - Operational Amplifiers; Standard Pack Qty: 2500; Subcategory: Amplifier ICs; RoHS - Mouser: Y; Minimum Order Quantity: 1; Reeling: True
U3 = TCA0372DWG: Operational Amplifiers - Op Amps 5-40V 1A Output Extended Temp; Manufacturer: ON Semiconductor; Amplifier Type: Power Amplifier; Supply Type: Single, Dual; Number of Channels: 2 Channel; CMRR - Common Mode Rejection Ratio: 70 dB; CNHTS: 8542319000; Dual Supply Voltage: +/- 5 V, +/- 9 V, +/- 12 V; en - Input Voltage Noise Density: 22 nV/sqrt Hz; GBP - Gain Bandwidth Product: 1.4 MHz; Ib - Input Bias Current: 500 nA; Maximum Dual Supply Voltage: +/- 20 V; Minimum Dual Supply Voltage: +/- 2.5 V; MXHTS: 85423399; Operating Supply Current: 5 mA; Operating Supply Voltage: 5 V to 40 V, +/- 2.5 V to +/- 20 V; SR - Slew Rate: 1.4 V/us; Supply Voltage - Max: 40 V; Supply Voltage - Min: 5 V; Vcm - Common Mode Voltage: Negative Rail to Positive Rail - 1 V; Voltage Gain dB: 100 dB; Vos - Input Offset Voltage: 15 mV; Supplier 1: Mouser; Manufacturer Part Number: TCA0372DWG; RoHS: RoHS Compliant; Category: Operational Amplifiers - Op Amps; Stock 1: 15287; Pricing 1: 1=1.09, 10=0.923, 100=0.709, 500=0.627, 1000=0.495, 2500=0.439, 10000=0.422, 25000=0.409 (USD); Height: 2.4 mm (Max); Length: 10.45 mm (Max); Package / Case: SOIC-16; Packaging: Tube; Product: Operational Amplifiers; Series: TCA0372; Technology: Bipolar; Width: 7.6 mm (Max); Brand: ON Semiconductor; Mounting Style: SMD/SMT; Shutdown: Shutdown; HTS Code: 8542330001; Maximum Operating Temperature: + 125 C; Minimum Operating Temperature: - 40 C; Output Current per Channel: 1 A; Product Type: Op Amps - Operational Amplifiers; PSRR - Power Supply Rejection Ratio: 70 dB; Standard Pack Qty: 47; Subcategory: Amplifier ICs; RoHS - Mouser: Y; Minimum Order Quantity: 1; Reeling: False; ComponentLink1URL: http://www.mouser.com/datasheet/2/308/TCA0372-D-116057.pdf; ComponentLink1Description: http://www.mouser.com/datasheet/2/308/TCA0372-D-116057.pdf
U4 = XTR111AIDGQT: Sensor Interface Prec Vltg-to-Crnt Conv/Transmitter; Manufacturer: Texas Instruments; Input Type: Voltage; Input Voltage: 0 V to 12 V; Output Current: 25 mA; Output Type: Current, Voltage; Output Voltage: 3 V to 15 V; Interface Type: 3-Wire; CNHTS: 8542319000; Ib - Input Bias Current: 15 nA; MXHTS: 85423999; Operating Supply Current: 450 uA; Operating Supply Voltage: 8 V to 40 V; Supply Voltage - Max: 40 V; Supply Voltage - Min: 8 V; Supplier 1: Mouser; Manufacturer Part Number: XTR111AIDGQT; RoHS: RoHS Compliant; Category: Sensor Interface; Stock 1: 11068; Pricing 1: 1=1.94, 10=1.65, 100=1.32, 250=1.32, 500=1.16, 1000=0.955, 2500=0.889, 5000=0.856, 10000=0.823 (USD); Features: Output Disable, Output Failure, Sub-Regulator Output; Height: 1.02 mm; Length: 3 mm; Package / Case: MSOP-PowerPad-10; Packaging: Cut Tape; Series: XTR111; Type: Current Transmitter; Width: 3 mm; Brand: Texas Instruments; Mounting Style: SMD/SMT; HTS Code: 8542390001; Maximum Operating Temperature: + 125 C; Minimum Operating Temperature: - 40 C; Product Type: Sensor Interface; Standard Pack Qty: 250; Subcategory: Interface ICs; RoHS - Mouser: Y; Minimum Order Quantity: 1; Reeling: True
Y1 = ECS-80-18-30B-AGN-TR: Crystals 8MHz 25ppm 18pF -40C +85C; Manufacturer: ECS; Frequency Stability: 30 PPM; CNHTS: 8541600000; Drive Level: 300 uW; MXHTS: 85416001; Supplier 1: Mouser; Manufacturer Part Number: ECS-80-18-30B-AGN-TR; RoHS: RoHS Compliant; Category: Crystals; Stock 1: 762; Pricing 1: 1=0.700, 10=0.575, 50=0.518, 100=0.460, 500=0.438, 1000=0.368, 2000=0.345, 5000=0.334, 10000=0.322 (USD); Frequency: 8 MHz; Height: 0.85 mm; Length: 5 mm; Load Capacitance: 18 pF; Package / Case: 5 mm x 3.2 mm; Packaging: Cut Tape; Product: Crystals; Series: ECX-53B; Termination Style: SMD/SMT; Tolerance: 25 PPM; Width: 3.2 mm; Brand: ECS; Mounting Style: SMD/SMT; HTS Code: 8541600050; Maximum Operating Temperature: + 85 C; Minimum Operating Temperature: - 40 C; Product Type: Crystals; Standard Pack Qty: 1000; Subcategory: Crystals; RoHS - Mouser: Y; Minimum Order Quantity: 1; Reeling: True; ComponentLink1URL: http://www.mouser.com/datasheet/2/122/ecx_53b-1479911.pdf; ComponentLink1Description: http://www.mouser.com/datasheet/2/122/ecx_53b-1479911.pdf